# EAGLE design n64-snac (EAGLE 7.7.0)
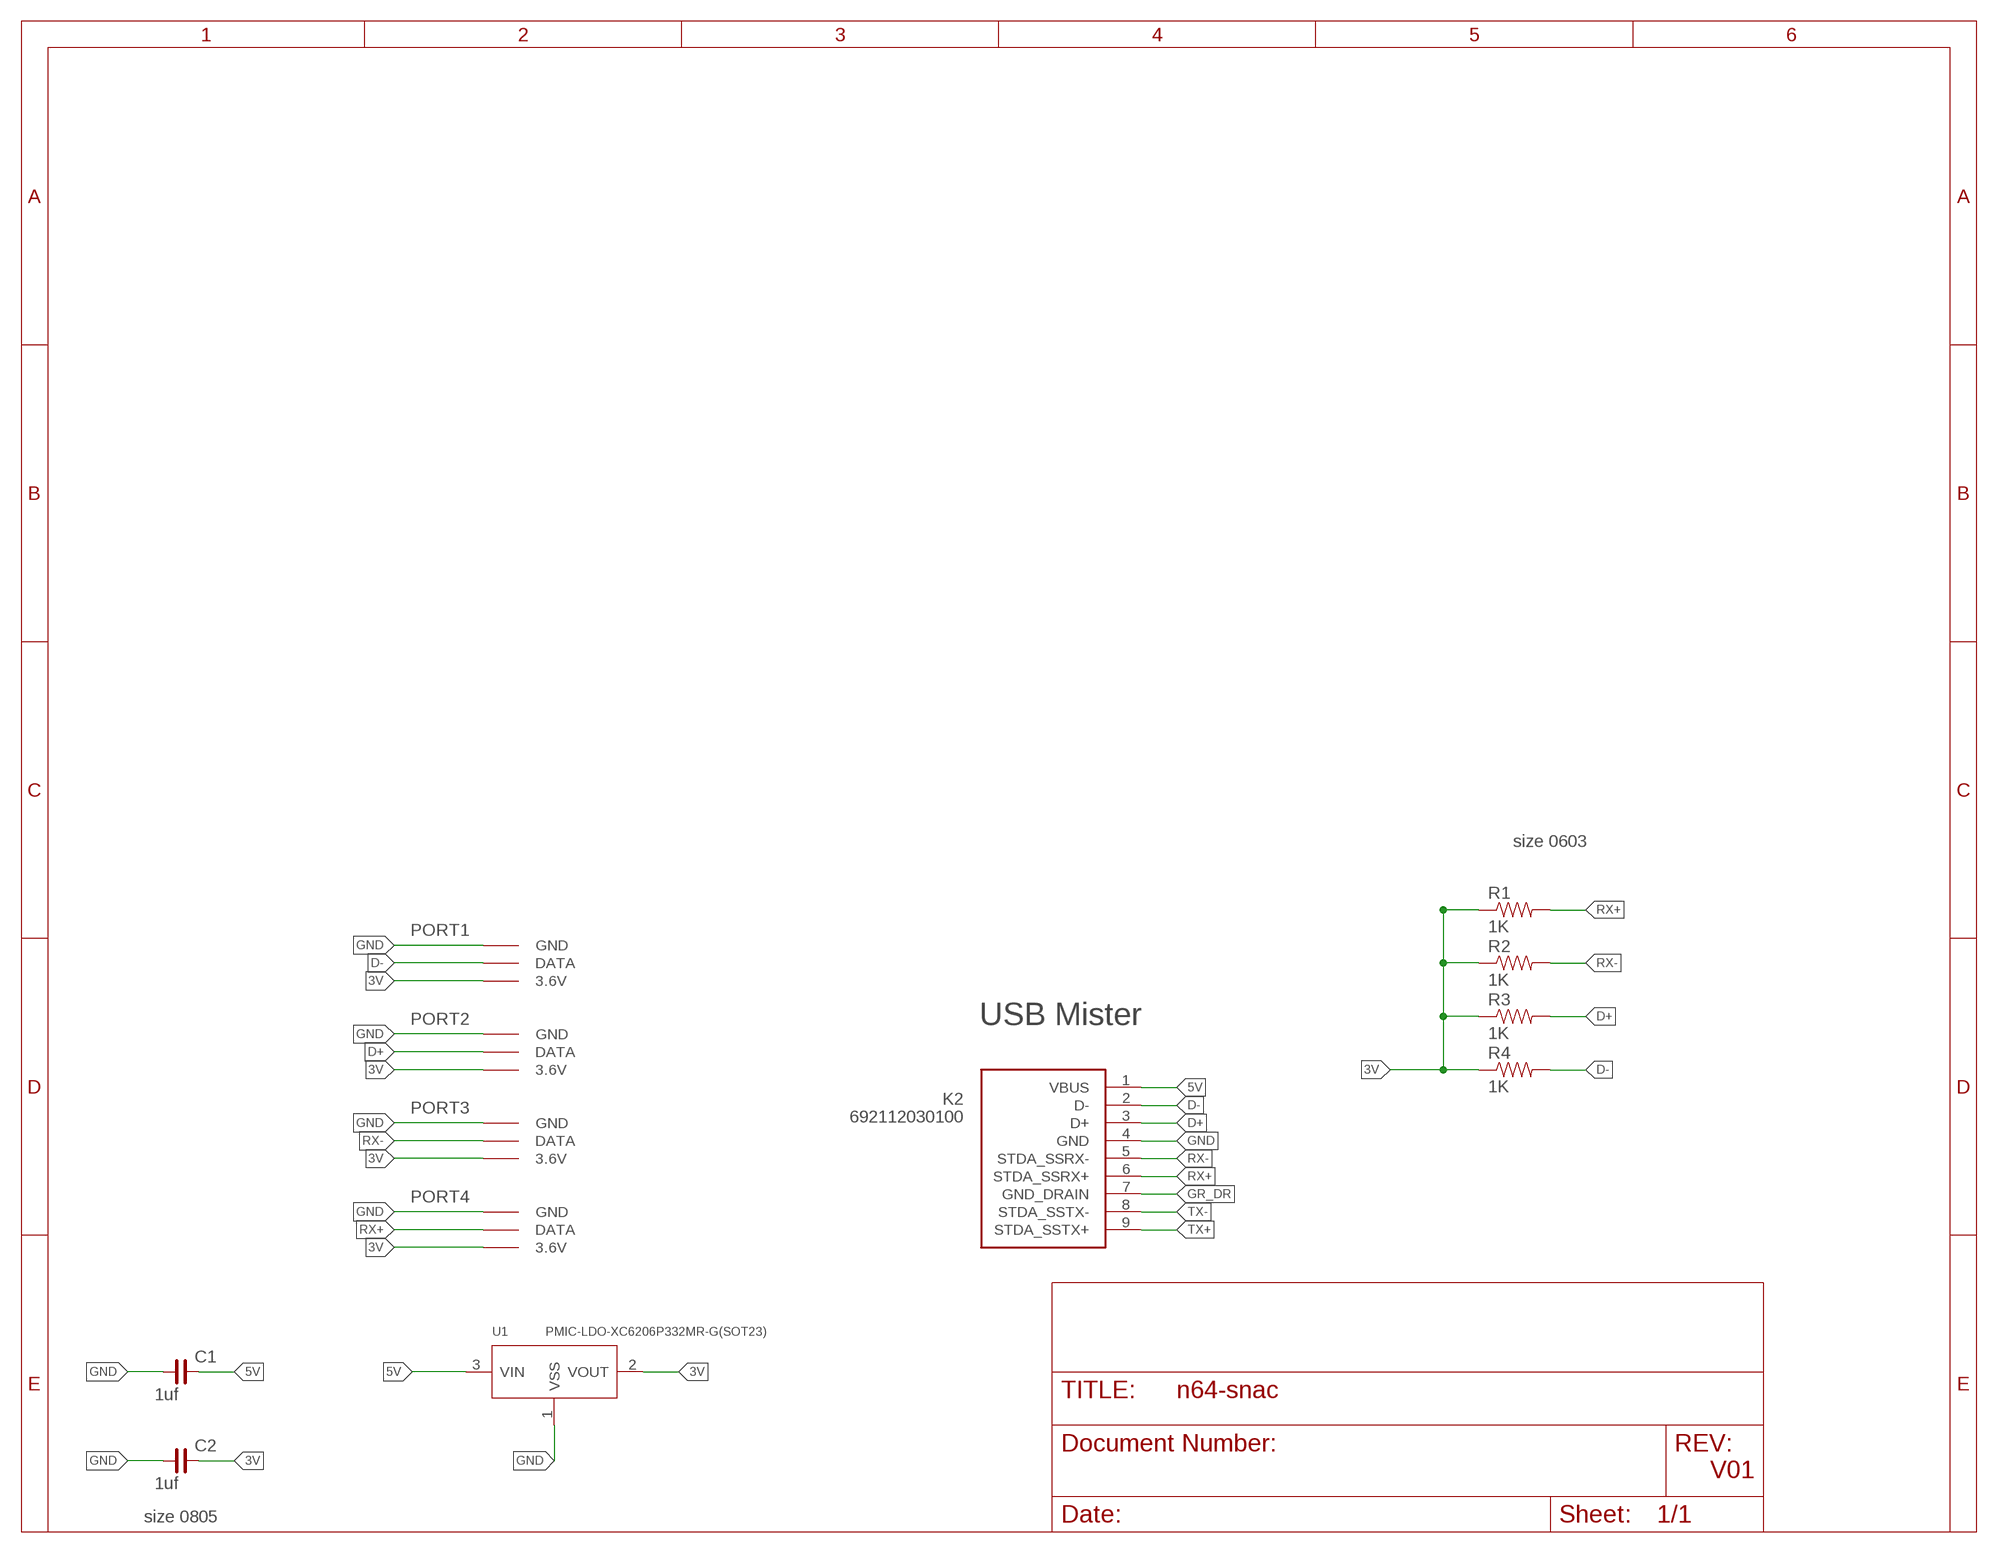
[diagram p0: schematic, sheet 1]

## Parts
C1  1uf  C_0805  [C0805]
C2  1uf  C_0805  [C0805]
K2  692112030100  [692112030100]
R1  1K  RESISTOR0603-RES  [0603-RES]
R2  1K  RESISTOR0603-RES  [0603-RES]
R3  1K  RESISTOR0603-RES  [0603-RES]
R4  1K  RESISTOR0603-RES  [0603-RES]
U1  PMIC-LDO-XC6206P332MR-G(SOT23)  [SOT-23]
U$1  N64CONN  [N64CONN]
U$2  N64CONN  [N64CONN]
U$3  N64CONN  [N64CONN]
U$4  N64CONN  [N64CONN]

## Nets
3V: C2.2 R1.1 R2.1 R3.1 R4.1 U1.2(VOUT) U$1.3.6V U$2.3.6V U$3.3.6V U$4.3.6V
5V: C1.2 K2.1(VBUS) U1.3(VIN)
D+: K2.3(D+) R3.2 U$1.DATA
D-: K2.2(D-) R4.2 U$3.DATA
GND: C1.1 C2.1 K2.4(GND) U1.1(VSS) U$1.GND U$2.GND U$3.GND U$4.GND
GR_DR: K2.7(GND_DRAIN)
RX+: K2.6(STDA_SSRX+) R1.2 U$4.DATA
RX-: K2.5(STDA_SSRX-) R2.2 U$2.DATA
TX+: K2.9(STDA_SSTX+)
TX-: K2.8(STDA_SSTX-)

## Notes on the sheet
- size 0603
- PORT1
- PORT2 | USB Mister
- PORT3
- PORT4
- V01
- size 0805

## Library data of the parts
C1 C2 = rc-master-smd:C_: NON-POLARIZED CAP
K2 = Wuerth_Elektronik_eiCan_Communication_Connectors_STENCIL:692112030100: WR-COM USB 3.0 SMT PLUG WITH CLIPTYPE A
R1-R4 = SparkFun:RESISTOR: Resistor Basic schematic elements and footprints for 0603, 1206, and PTH resistors.
U1 = PMIC-LDO-XC6206P332MR-G_SOT23_:PMIC-LDO-XC6206P332MR-G(SOT23): 310030099; AVAILABILITY: Unavailable; DESCRIPTION: SMD PMIC; LDO; Vin 6V; 3.3V; 200mA; Without En; 1-Ch; MF: Torex; MP: XC6206P332MR-G; PACKAGE: SOT-23-3 Torex; PRICE: None
U$1-U$4 = gamepad-conn:N64CONN

## Board
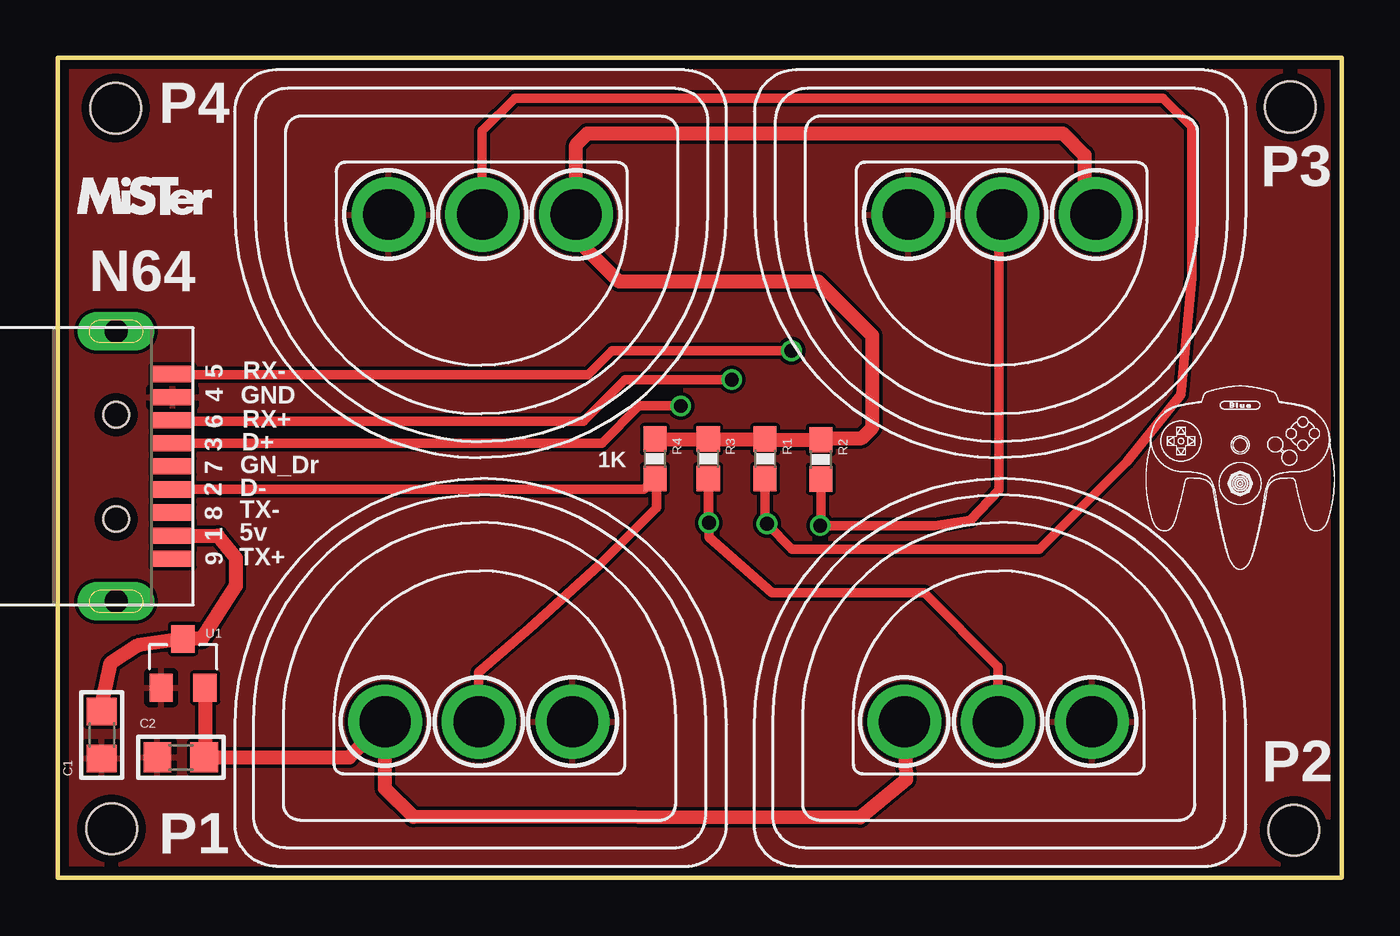
[diagram p1: board, top side]
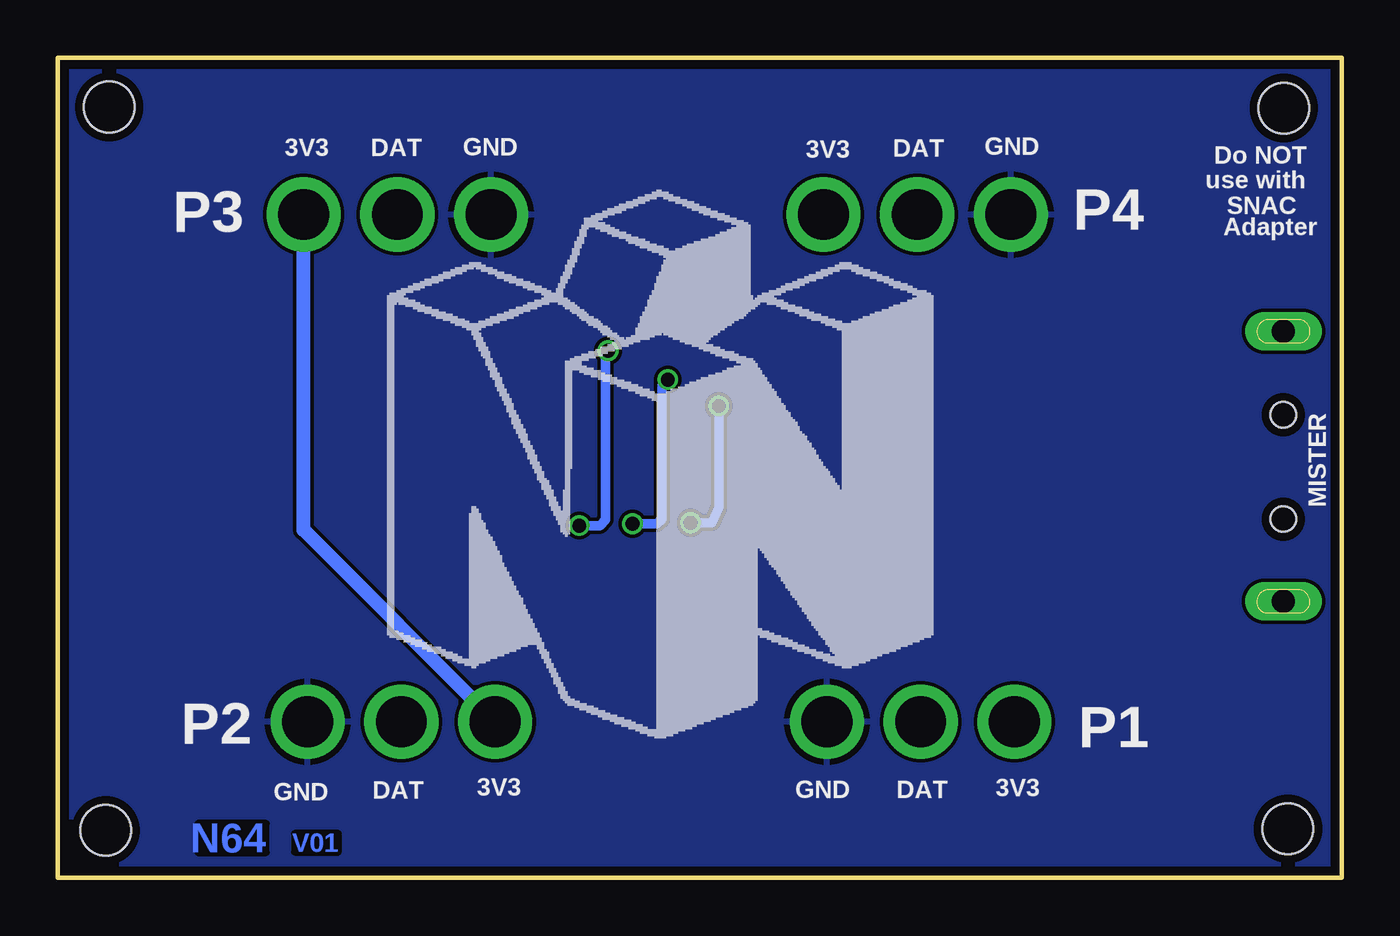
[diagram p2: board, bottom side, seen from below]

Size 55.65 x 35.53 mm. Coordinates in mm from the lower left corner, seen from the top.
Outline: 0,0 55.65,0 55.65,35.53 0,35.53 0,0
Copper layers (1*16): Top 0.035559375mm / dielectric 1.6mm / Bottom 0.035559375mm
Design rules "oshpark-2layer": minimum track width 6mil, minimum drill 10mil, track to track 6mil, track to pad 6mil, pad to pad 6mil, via to via 6mil, smd to smd 6mil, copper to edge 15mil, drill to drill 6mil, minimum pad ring 5mil, minimum via ring 5mil, stop-mask expansion 2.5mil, vias tented up to drill 0mil, thermal gap 10mil
Holes 2.2 mm at 53.57,2.06 2.51,33.35 53.42,33.4 2.34,2.13
Holes 1.1 mm at 2.54,20.07 2.54,15.54

### Footprints (pad centres in the part's own frame; a part is rotated, then mirrored left to right if it is on the bottom)
C0805 = smd 1.2 x 1.3: 1 -1.016,0; 2 1.016,0
692112030100 = smd 0.7 x 1.8: 1 -3,0; 2 -1,0; 3 1,0; 4 3,0; 5 4,0; 6 2,0; 7 0,0; 8 -2,0; 9 -4,0 | drill 1 pad 1.676 long: Z1 5.85,2.45; Z2 -5.85,2.45
0603-RES = smd 1.1 x 1: 1 -0.85,0; 2 0.85,0
SOT-23 = smd 1.016 x 1.2: 1 -0.95,-1.06; 2 0.95,-1.06; 3 0,1.06
N64CONN = drill 2.2 pad 3.1: 3.6V -4,0.064; DATA 0.064,0.064; GND 4.128,0.064

### Placement (x,y rotation side)
C1  1.92,6.2 90 top
C2  5.33,5.22 0 top
K2  4.98,17.83 90 top
R1  30.66,18.16 270 top
R2  33.07,18.14 270 top
R3  28.19,18.16 270 top
R4  25.88,18.16 270 top
U1  5.44,9.3 0 top
U$1  40.69,6.71 0 top
U$2  41,28.8 180 top
U$3  18.19,6.71 0 top
U$4  18.47,28.8 180 top

### Tracks (layer width: path | path; a pad name or v marks a point on that pad's centre or on a via)
3V
  Top 0.61: U1.2 6.39,5.25 C2.2 12.64,5.22 U$3.3.6V 14.19,3.87 15.42,2.64 34.77,2.62 36.77,4.25 U$1.3.6V | U$2.3.6V 44.5,29.23 44.5,31.32 43.56,32.26 22.96,32.26 22.47,31.76 U$4.3.6V 22.47,27.7 24.33,25.83 32.97,25.83 35.31,23.5 35.31,19.51 34.85,19.05 33.14,19.05 R2.1 30.68,18.99 R1.1 R3.1 R4.1
  Bottom 0.61: U$1.3.6V 45,15.07 U$2.3.6V
5V
  Top 0.61: K2.1 6.94,14.83 7.72,13.87 7.72,12.65 6.24,10.36 U1.3 3.47,10.08 2.29,9.3 1.88,7.48 C1.2
D+  (via drill 0.6)
  Top 0.406: K2.3 23.58,18.83 25.2,20.45 v27,20.45 | U$1.DATA 40.75,9.16 37.57,12.34 30.96,12.34 28.22,14.76 v28.22,15.39 28.19,15.75 R3.2 28.3,17.21
  Bottom 0.406: v28.22,15.39 27.31,15.39 27,16.05 v27,20.45
D-
  Top 0.406: K2.2 25.4,16.83 R4.2 25.96,17.23 25.96,16.03 23.47,13.54 20.45,10.82 18.25,8.9 U$3.DATA
GND
  pour Top: -0.03,35.53 55.55,35.51 55.68,-0.05 0,0
  pour Bottom: -0.03,35.51 55.6,35.59 55.68,-0.05 -0.03,0
RX+  (via drill 0.6)
  Top 0.406: K2.6 5.02,19.79 22.78,19.79 24.59,21.59 v29.21,21.59 | U$4.DATA 18.4,32.37 19.81,33.78 47.9,33.78 49.15,32.54 49.15,26.01 48.67,20.93 46.33,18.03 42.55,14.25 31.83,14.25 v30.73,15.34 30.66,15.42 R1.2
  Bottom 0.406: v29.21,21.59 29.46,21.34 29.46,15.54 29.67,15.34 v30.73,15.34
RX-  (via drill 0.6)
  Top 0.406: K2.5 5.02,21.79 22.99,21.79 24.03,22.84 v31.8,22.84 | U$2.DATA 40.79,28.6 40.79,16.79 39.55,15.49 38,15.27 v33.05,15.27 33.07,15.29 R2.2
  Bottom 0.406: v31.8,22.84 31.9,22.73 31.9,15.52 32.16,15.27 v33.05,15.27

### Text on the board
Bottom: V01 | N64
tPlace: P4 | P3 | N64 | 5 | RX- | 4 | GND | RX+ | 6 | D+ | 3 | 7 | GN_Dr | 1K | 2 | D- | TX- | 1 | 8 | 5v | 9 | TX+ | P2 | P1
bPlace: GND | DAT | 3V3 | GND | DAT | 3V3 | Do NOT | SNAC | use with | Adapter | P4 | P3 | MISTER | P1 | P2 | 3V3 | DAT | GND | 3V3 | DAT | GND
tValues: + | -